# EAGLE design schematic (EAGLE 9.6.2)
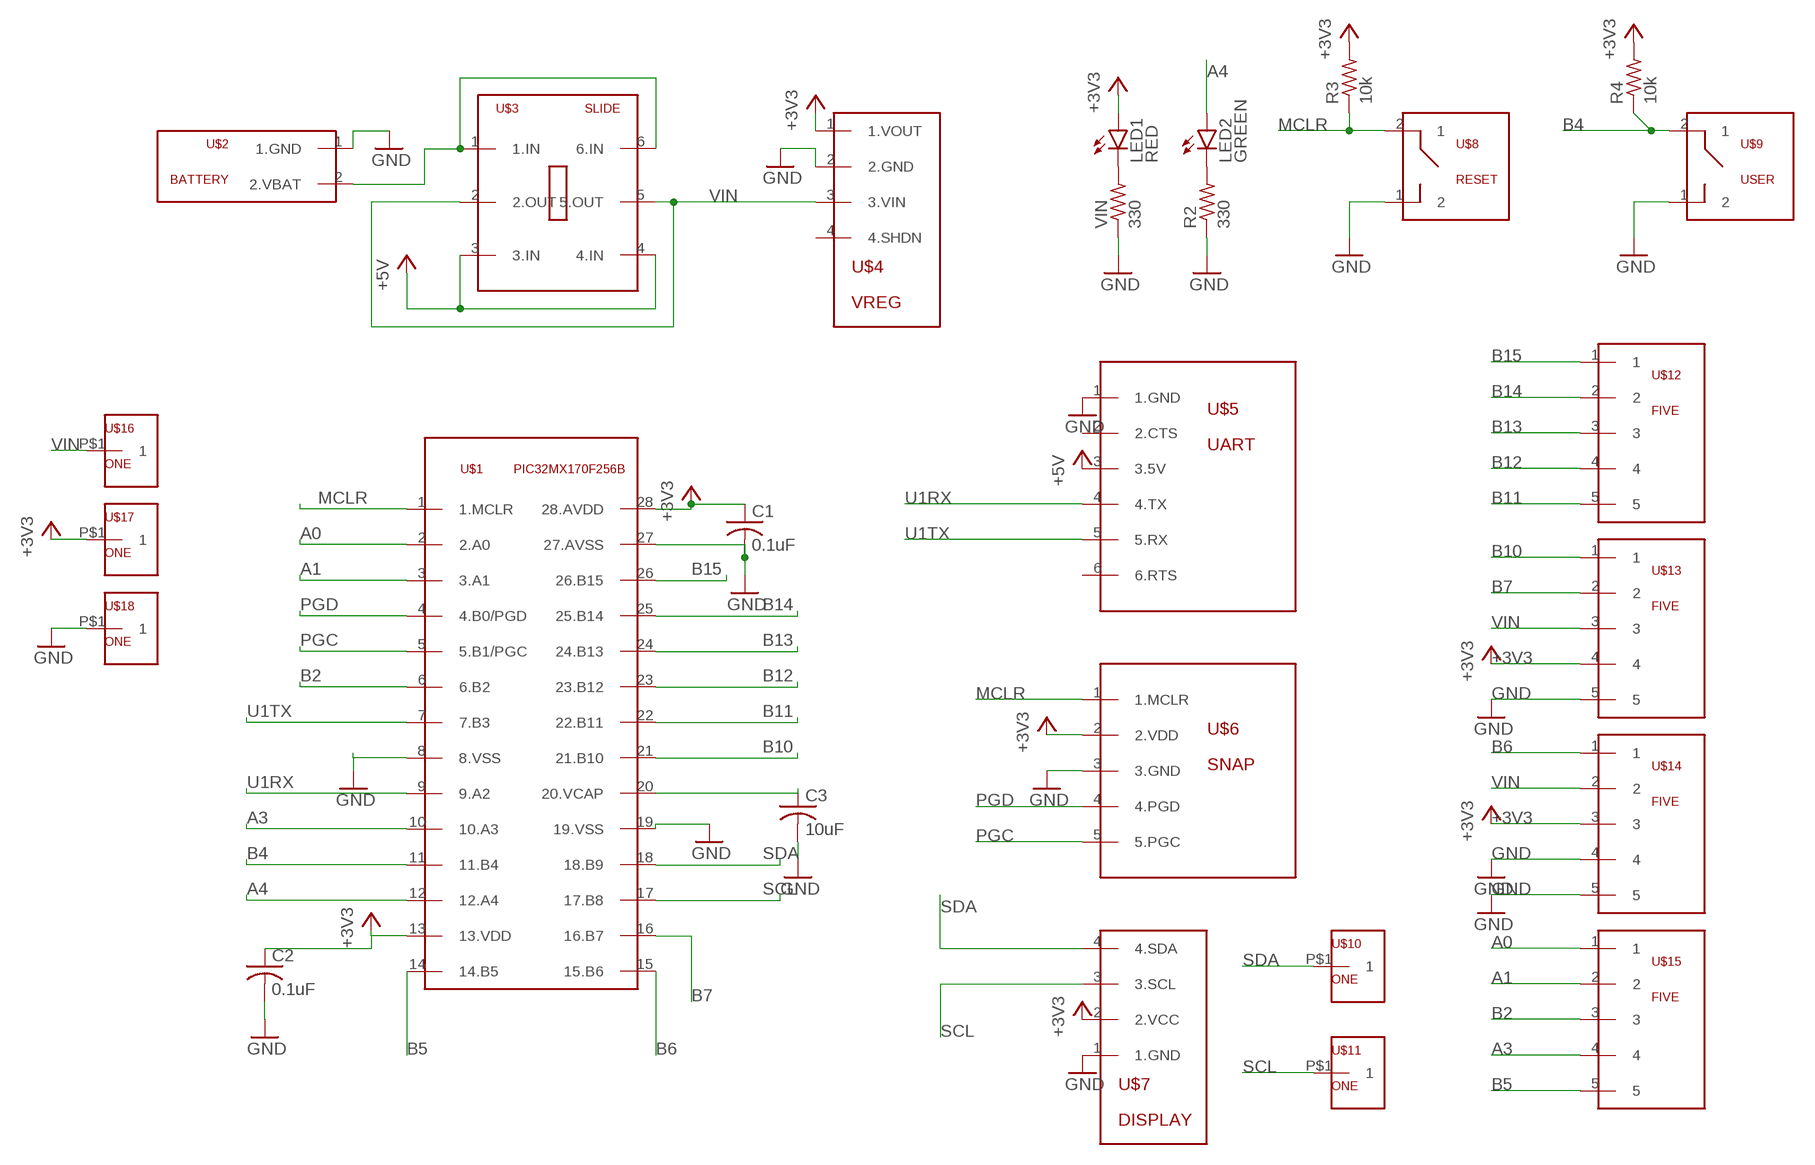
[diagram p0: schematic, sheet 1]

## Parts
C1  0.1uF  C-US025-024X044  [C025-024X044]
C2  0.1uF  C-US025-024X044  [C025-024X044]
C3  10uF  C-US025-024X044  [C025-024X044]
LED1  RED  LED3MM  [LED3MM]
LED2  GREEN  LED3MM  [LED3MM]
R2  330  R-US_0207/7  [0207/7]
R3  10k  R-US_0207/7  [0207/7]
R4  10k  R-US_0207/7  [0207/7]
U$1  PIC32MX170F256B  [DIL28-3]
U$2  BATTERY  [BATTERY]
U$3  SLIDE  [SLIDE]
U$4  VREG  [VREG]
U$5  UART  [USBUART]
U$6  SNAP  [SNAP]
U$7  DISPLAY  [DISPLAY]
U$8  RESET  BUTTON  [PUSH]
U$9  USER  BUTTON  [PUSH]
U$10  ONE  [ONE]
U$11  ONE  [ONE]
U$12  FIVE  [FIVE]
U$13  FIVE  [FIVE]
U$14  FIVE  [FIVE]
U$15  FIVE  [FIVE]
U$16  ONE  [ONE]
U$17  ONE  [ONE]
U$18  ONE  [ONE]
VIN  330  R-US_0207/7  [0207/7]

## Nets
+3V3: C1.1 C2.1 LED1.A R3.2 R4.2 U$1.13(13.VDD) U$1.28(28.AVDD) U$4.1(1.VOUT) U$6.2(2.VDD) U$7.2(2.VCC) U$13.4 U$14.3 U$17.P$1
+5V: U$3.3(3.IN) U$3.4(4.IN) U$5.3(3.5V)
A0: U$1.2(2.A0) U$15.1
A1: U$1.3(3.A1) U$15.2
A3: U$1.10(10.A3) U$15.4
A4: LED2.A U$1.12(12.A4)
B2: U$1.6(6.B2) U$15.3
B4: R4.1 U$1.11(11.B4) U$9.2
B5: U$1.14(14.B5) U$15.5
B6: U$1.15(15.B6) U$14.1
B7: U$1.16(16.B7) U$13.2
B10: U$1.21(21.B10) U$13.1
B11: U$1.22(22.B11) U$12.5
B12: U$1.23(23.B12) U$12.4
B13: U$1.24(24.B13) U$12.3
B14: U$1.25(25.B14) U$12.2
B15: U$1.26(26.B15) U$12.1
GND: C1.2 C2.2 C3.2 R2.1 U$1.8(8.VSS) U$1.19(19.VSS) U$1.27(27.AVSS) U$2.1(1.GND) U$4.2(2.GND) U$5.1(1.GND) U$6.3(3.GND) U$7.1(1.GND) U$8.1 U$9.1 U$13.5 U$14.4 U$14.5 U$18.P$1 VIN.1
MCLR: R3.1 U$1.1(1.MCLR) U$6.1(1.MCLR) U$8.2
N$1: LED1.K(C) VIN.2
N$2: LED2.K(C) R2.2
N$3: U$2.2(2.VBAT) U$3.1(1.IN) U$3.6(6.IN)
N$4: C3.1 U$1.20(20.VCAP)
PGC: U$1.5(5.B1/PGC) U$6.5(5.PGC)
PGD: U$1.4(4.B0/PGD) U$6.4(4.PGD)
SCL: U$1.17(17.B8) U$7.3(3.SCL) U$11.P$1
SDA: U$1.18(18.B9) U$7.4(4.SDA) U$10.P$1
U1RX: U$1.9(9.A2) U$5.4(4.TX)
U1TX: U$1.7(7.B3) U$5.5(5.RX)
VIN: U$3.2(2.OUT) U$3.5(5.OUT) U$4.3(3.VIN) U$13.3 U$14.2 U$16.P$1
Unconnected: U$4.4(4.SHDN) U$5.2(2.CTS) U$5.6(6.RTS)

## Library data of the parts
C1-C3 = hw4:C-US: CAPACITOR, American symbol; SPICEPREFIX: C
LED1 LED2 = hw4:LED: LED OSRAM: - CHIPLED LG R971, LG N971, LY N971, LG Q971, LY Q971, LO R971, LY R971 LH N974, LH R974 LS Q976, LO Q976, LY Q976 LO Q996 - Hyper CHIPLED LW Q18S LB Q993, LB Q99A, LB R99A - SideLED LS A670, LO A670, LY A670, LG A670, LP A670 LB A673, LV A673, LT A673, LW A673 LH A674 LY A675 LS A676, LA A676, LO A676, LY A676, LW A676 LS A679, LY A679, LG A679 - Hyper Micro SIDELED® LS Y876, LA Y876, LO Y876, LY Y876 LT Y87S - SmartLED LW L88C, LW L88S LB L89C, LB L89S, LG L890 LS L89K, LO L89K, LY L89K LS L896, LA L896, LO L896, LY L896 - TOPLED LS T670, LO T670, LY T670, LG T670, LP T670 LSG T670, LSP T670, LSY T670, LOP T670, LYG T670 LG T671, LOG T671, LSG T671 LB T673, LV T673, LT T673, LW T673 LH T674 LS T676, LA T676, LO T676, LY T676, LB T676, LH T676, LSB T676, LW T676 LB T67C, LV T67C, LT T67C, LS T67K, LO T67K, LY T67K, LW E67C LS E67B, LA E67B, LO E67B, LY E67B, LB E67C, LV E67C, LT E67C LW T67C LS T679, LY T679, LG T679 LS T770, LO T770, LY T770, LG T770, LP T770 LB T773, LV T773, LT T773, LW T773 LH T774 LS E675, LA E675, LY E675, LS T675 LS T776, LA T776, LO T776, LY T776, LB T776 LHGB T686 LT T68C, LB T68C - Hyper Mini TOPLED® LB M676 - Mini TOPLED Santana® LG M470 LS M47K, LO M47K, LY M47K Source: http://www.osram.convergy.de LUXEON: - LUMILED® LXK2-PW12-R00, LXK2-PW12-S00, LXK2-PW14-U00, LXK2-PW14-V00 LXK2-PM12-R00, LXK2-PM12-S00, LXK2-PM14-U00 LXK2-PE12-Q00, LXK2-PE12-R00, LXK2-PE12-S00, LXK2-PE14-T00, LXK2-PE14-U00 LXK2-PB12-K00, LXK2-PB12-L00, LXK2-PB12-M00, LXK2-PB14-N00, LXK2-PB14-P00, LXK2-PB14-Q00 LXK2-PR12-L00, LXK2-PR12-M00, LXK2-PR14-Q00, LXK2-PR14-R00 LXK2-PD12-Q00, LXK2-PD12-R00, LXK2-PD12-S00 LXK2-PH12-R00, LXK2-PH12-S00 LXK2-PL12-P00, LXK2-PL12-Q00, LXK2-PL12-R00 Source: www.luxeon.com KINGBRIGHT: KA-3528ASYC Source: www.kingbright.com
R2-R4 VIN = hw4:R-US_: RESISTOR, American symbol; SPICEPREFIX: R
U$1 = hw4:PIC32MX170F256B
U$2 = hw4:BATTERY
U$3 = hw4:SLIDE
U$4 = hw4:VREG
U$5 = hw4:UART
U$6 = hw4:SNAP
U$7 = hw4:DISPLAY
U$8 U$9 = hw4:BUTTON
U$10 U$11 U$16-U$18 = hw4:ONE
U$12-U$15 = hw4:FIVE

## Board
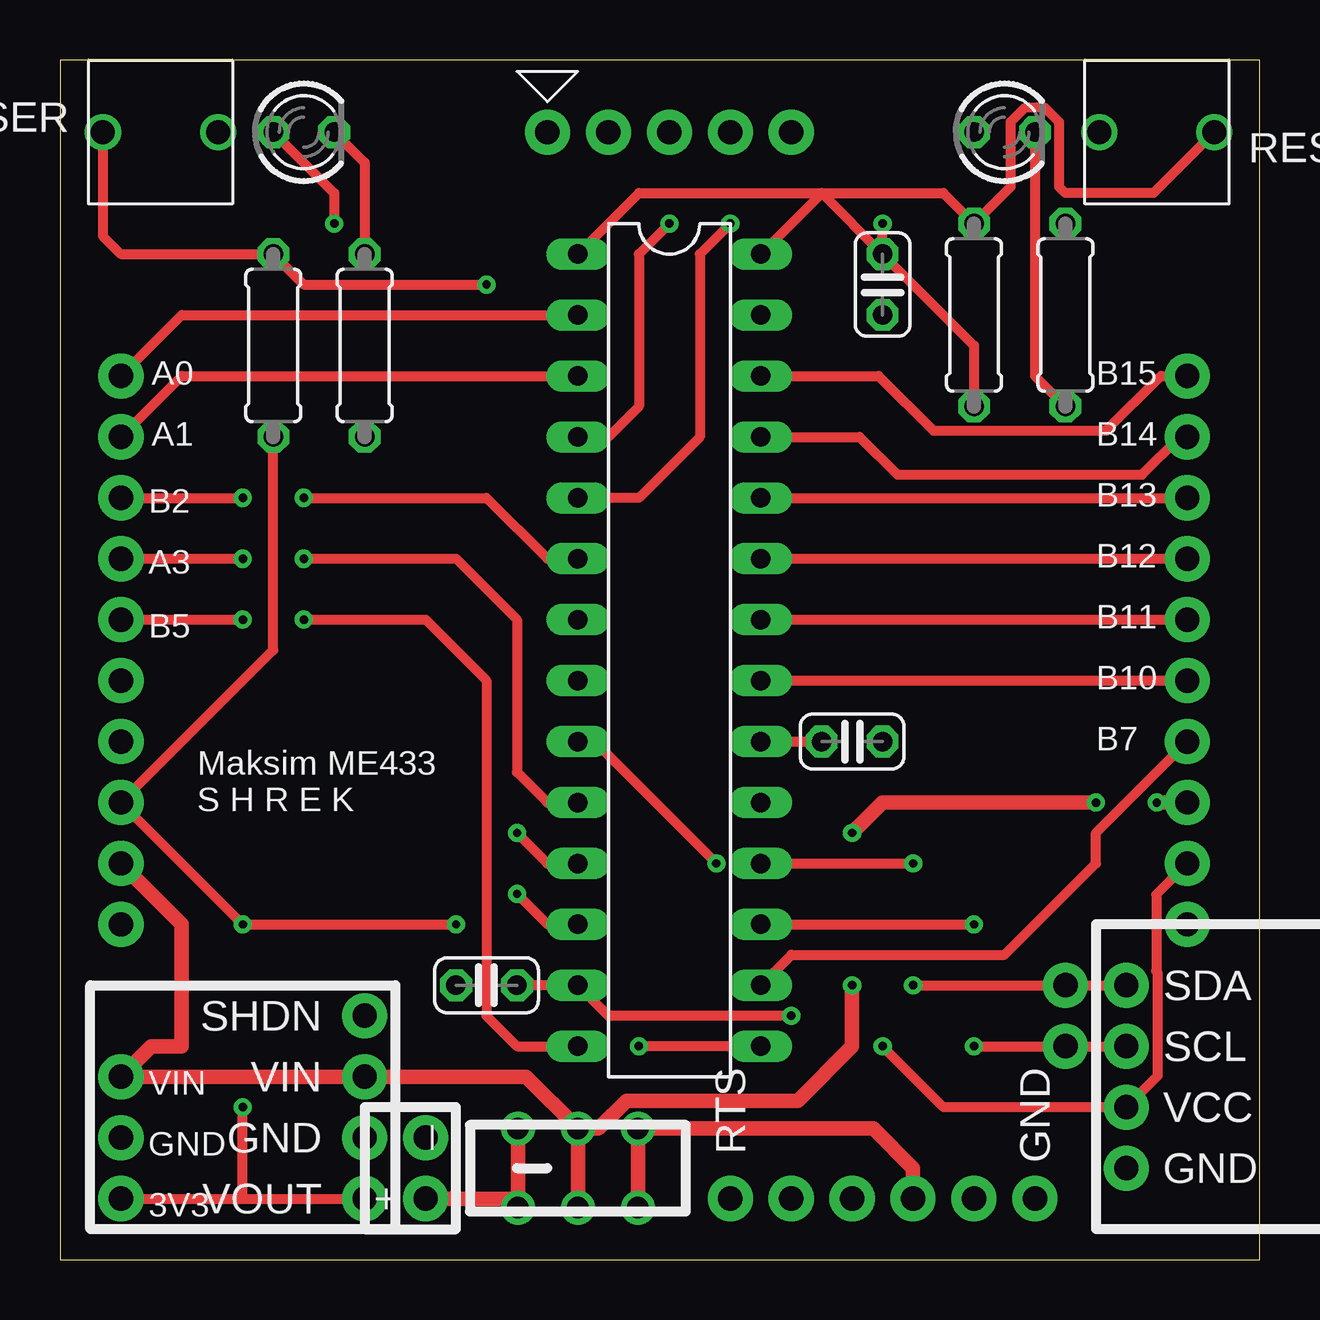
[diagram p1: board, top side]
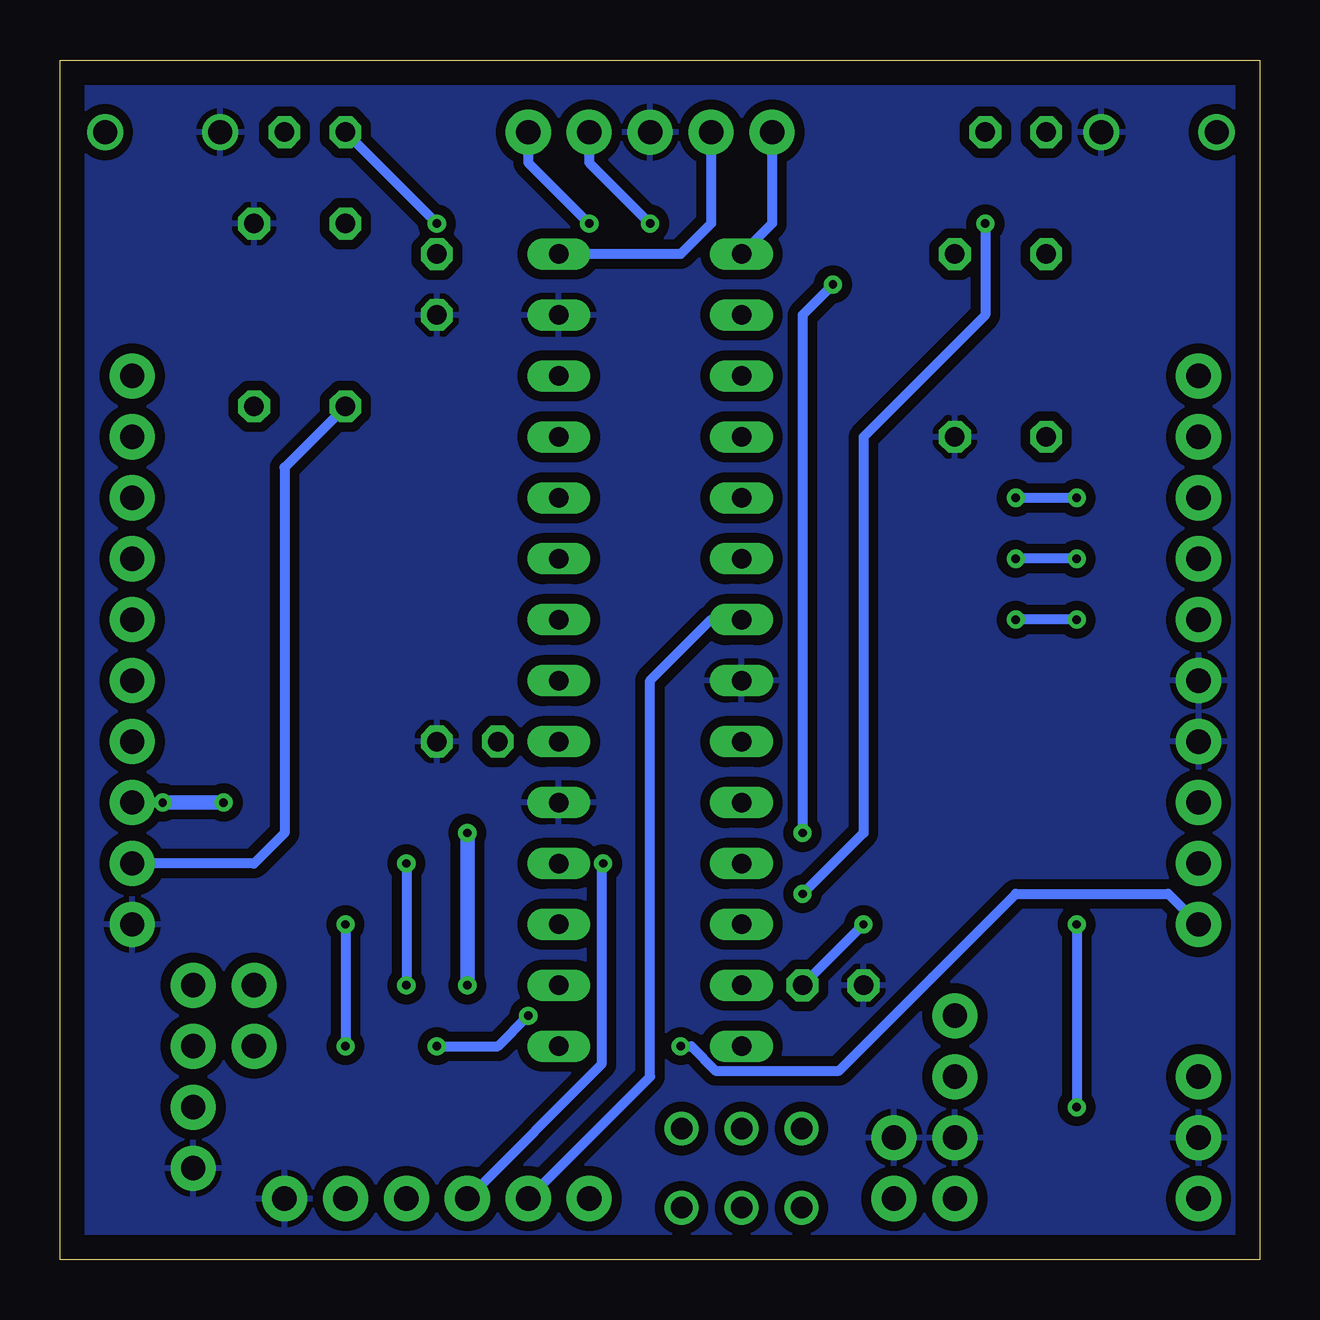
[diagram p2: board, bottom side, seen from below]

Size 50 x 50 mm. Coordinates in mm from the lower left corner, seen from the top.
Outline: 0,0 50,0 50,50 0,50 0,0
Copper layers (1*16): Top 0.035mm / dielectric 1.5mm / Bottom 0.035mm
Design rules "default": minimum track width 6mil, minimum drill 0.35mm, track to track 6mil, track to pad 6mil, pad to pad 6mil, via to via 6mil, smd to smd 6mil, copper to edge 40mil, drill to drill 6mil, minimum pad ring 10mil, minimum via ring 8mil, stop-mask expansion 4mil, vias tented up to drill 0mil, thermal gap 10mil

### Footprints (pad centres in the part's own frame; a part is rotated, then mirrored left to right if it is on the bottom)
C025-024X044 = drill 0.813 octagon: 1 -1.27,0; 2 1.27,0
LED3MM = drill 0.813 octagon: A -1.27,0; K 1.27,0
0207/7 = drill 0.813 octagon: 1 -3.81,0; 2 3.81,0
DIL28-3 = drill 0.813 long: 1 -16.51,-3.81; 2 -13.97,-3.81; 3 -11.43,-3.81; 4 -8.89,-3.81; 5 -6.35,-3.81; 6 -3.81,-3.81; 7 -1.27,-3.81; 8 1.27,-3.81; 9 3.81,-3.81; 10 6.35,-3.81; 11 8.89,-3.81; 12 11.43,-3.81; 13 13.97,-3.81; 14 16.51,-3.81; 15 16.51,3.81; 16 13.97,3.81; 17 11.43,3.81; 18 8.89,3.81; 19 6.35,3.81; 20 3.81,3.81; 21 1.27,3.81; 22 -1.27,3.81; 23 -3.81,3.81; 24 -6.35,3.81; 25 -8.89,3.81; 26 -11.43,3.81; 27 -13.97,3.81; 28 -16.51,3.81
BATTERY = drill 1.016 pad 1.88: 1 -1.27,0; 2 1.27,0
SLIDE = drill 0.9: 1 -2.5,-1.65; 2 0,-1.65; 3 2.5,-1.65; 4 2.5,1.65; 5 0,1.65; 6 -2.5,1.65
VREG = drill 1.016 pad 1.88: 1 -3.81,0; 2 -1.27,0; 3 1.27,0; 4 3.81,0
USBUART = drill 1.016 pad 1.88: 1 -6.35,0; 2 -3.81,0; 3 -1.27,0; 4 1.27,0; 5 3.81,0; 6 6.35,0
SNAP = drill 1.016 pad 1.88: 1 -5.08,0; 2 -2.54,0; 3 0,0; 4 2.54,0; 5 5.08,0
DISPLAY = drill 1.016 pad 1.88: 1 0,-3.81; 2 0,-1.27; 3 0,1.27; 4 0,3.81
PUSH = drill 1: 1 -2.4,0; 2 2.4,0
ONE = drill 1.016 pad 1.88: P$1 0,0
FIVE = drill 1.016 pad 1.88: 1 -5.08,0; 2 -2.54,0; 3 0,0; 4 2.54,0; 5 5.08,0

### Placement (x,y rotation side)
C1  34.29,40.64 270 top
C2  17.78,11.43 180 top
C3  33.02,21.59 0 top
LED1  39.37,46.99 0 top
LED2  10.16,46.99 0 top
R2  12.7,38.1 90 top
R3  38.1,39.37 270 top
R4  8.89,38.1 270 top
U$1  25.4,25.4 270 top
U$2  15.24,3.81 270 top
U$3  21.59,3.81 0 top
U$4  12.7,6.35 90 top
U$5  34.29,2.54 180 top
U$6  25.4,46.99 0 top
U$7  44.45,7.62 0 top
U$8  45.72,46.99 0 top
U$9  4.19,46.99 180 top
U$10  41.91,11.43 0 top
U$11  41.91,8.89 0 top
U$12  46.99,31.75 270 top
U$13  46.99,19.05 270 top
U$14  2.54,19.05 90 top
U$15  2.54,31.75 270 top
U$16  2.54,7.62 0 top
U$17  2.54,2.54 0 top
U$18  2.54,5.08 0 top
VIN  41.91,39.37 270 top

### Tracks (layer width: path | path; a pad name or v marks a point on that pad's centre or on a via)
+3V3  (via drill 0.35)
  Top 0.406: C2.1 U$1.13 22.86,10.16 v30.48,10.16 | U$1.28 31.75,44.45 C1.1 | C1.1 v34.29,43.18 | C1.1 38.1,38.1 R3.2 | U$13.4 45.7,15.21 45.7,12.02 45.74,11.97 45.74,7.64 U$7.2 36.83,6.35 v34.29,8.89 | R4.2 8.89,25.4 U$14.3 v7.62,13.97 v16.51,13.97 | U$17.P$1 7.62,2.54 | 7.62,2.54 U$4.1 | 7.62,2.54 v7.62,6.35
  Bottom 0.406: v34.29,43.18 LED1.A | U$6.2 22.86,43.18 24.13,41.91 U$1.28 | v7.62,13.97 v7.62,6.35 | v16.51,13.97 C2.1 | v34.29,8.89 31.75,8.89 v30.48,10.16 | R3.2 40.64,33.02 40.64,17.78 41.91,16.51 U$13.4
+5V
  Top 0.61: U$3.3 U$3.4 33.91,5.46 35.56,3.81 U$5.3
A0
  Top 0.406: U$15.1 5.08,39.37 U$1.2
A1
  Top 0.406: U$15.2 5.08,36.83 U$1.3
A3  (via drill 0.35)
  Top 0.406: U$15.4 v7.62,29.21 | v10.16,29.21 16.51,29.21 19.05,26.67 19.05,20.32 20.32,19.05 U$1.10
  Bottom 0.406: v7.62,29.21 v10.16,29.21
A4  (via drill 0.35)
  Top 0.406: LED2.A 11.43,44.45 v11.43,43.18 | v19.05,15.24 20.32,13.97 U$1.12
  Bottom 0.406: v11.43,43.18 11.43,39.37 16.51,34.29 16.51,17.78 v19.05,15.24
B2  (via drill 0.35)
  Top 0.406: U$15.3 v7.62,31.75 | v10.16,31.75 17.78,31.75 20.32,29.21 U$1.6
  Bottom 0.406: v7.62,31.75 v10.16,31.75
B4  (via drill 0.35)
  Top 0.406: U$9.2 1.79,42.66 2.54,41.91 R4.1 10.16,40.64 v17.78,40.64 | v19.05,17.78 20.32,16.51 U$1.11
  Bottom 0.406: v17.78,40.64 19.05,39.37 v19.05,17.78
B5  (via drill 0.35)
  Top 0.406: U$15.5 v7.62,26.67 | v10.16,26.67 15.24,26.67 17.78,24.13 17.78,10.16 19.05,8.89 U$1.14
  Bottom 0.406: v7.62,26.67 v10.16,26.67
B6  (via drill 0.35)
  Top 0.406: U$1.15 v24.13,8.89
  Bottom 0.406: v24.13,8.89 23.69,8.89 22.67,7.87 17.53,7.87 10.16,15.24 3.81,15.24 U$14.1
B7
  Top 0.406: U$1.16 30.48,12.7 39.37,12.7 43.18,16.51 43.18,17.78 U$13.2
B10
  Top 0.406: U$1.21 U$13.1
B11
  Top 0.406: U$1.22 U$12.5
B12
  Top 0.406: U$1.23 U$12.4
B13
  Top 0.406: U$1.24 U$12.3
B14
  Top 0.406: U$1.25 33.33,34.29 34.91,32.72 45.1,32.72 46.68,34.29 U$12.2
B15
  Top 0.406: U$1.26 34.12,36.83 36.41,34.54 43.6,34.54 45.89,36.83 U$12.1
GND
  pour Bottom (isolate 0.406): 0,0 50.8,0 50.8,50.8 0,50.8
MCLR
  Top 0.406: U$8.2 45.58,44.45 41.91,44.45 41.66,44.7 41.66,47.41 41.06,48.01 40.22,48.01 39.62,47.41 39.62,44.7 R3.1 36.83,44.45 24.13,44.45 U$1.1
  Bottom 0.406: U$6.1 20.32,43.18 U$1.1
N$1
  Top 0.406: LED1.K 40.64,36.83 VIN.2
N$2
  Top 0.406: LED2.K 12.7,45.72 R2.2
N$3
  Top 0.61: U$3.6 U$3.1 18.71,2.54 U$2.2
N$4
  Top 0.406: U$1.20 C3.1
PGC  (via drill 0.35)
  Top 0.406: v27.94,43.18 26.67,41.91 26.67,34.29 24.13,31.75 U$1.5
  Bottom 0.406: U$6.5 30.48,45.72 v27.94,43.18
PGD  (via drill 0.35)
  Top 0.406: v25.4,43.18 24.13,41.91 24.13,35.56 22.86,34.29 U$1.4
  Bottom 0.406: U$6.4 27.94,45.72 v25.4,43.18
SCL  (via drill 0.35)
  Top 0.406: U$1.17 v38.1,13.97 | v38.1,8.89 U$11.P$1 U$7.3
  Bottom 0.406: v38.1,13.97 v38.1,8.89
SDA  (via drill 0.35)
  Top 0.406: U$1.18 v35.56,16.51 | v35.56,11.43 U$10.P$1 U$7.4
  Bottom 0.406: v35.56,16.51 v35.56,11.43
U1RX  (via drill 0.35)
  Top 0.406: v27.36,16.51 22.28,21.59 U$1.9
  Bottom 0.406: U$5.4 27.43,8.13 27.43,16.44 v27.36,16.51
U1TX
  Bottom 0.406: U$1.7 22.86,26.67 25.4,24.13 25.4,7.62 U$5.5
VIN  (via drill 0.35)
  Top 0.61: U$3.5 U$3.2 | U$3.5 19.43,7.62 U$4.3 U$16.P$1 3.81,8.89 5.08,8.89 5.08,13.97 U$14.2 | U$3.5 22.45,5.46 23.61,6.62 30.75,6.62 33.02,8.89 v33.02,11.43 | v33.02,17.78 34.29,19.05 v43.18,19.05 | v45.72,19.05 U$13.3
  Bottom 0.61: v33.02,11.43 v33.02,17.78 | v43.18,19.05 v45.72,19.05

### Text on the board
tPlace: A0 | B15 | A1 | B14 | B2 | B13 | A3 | B12 | B5 | B11 | B10 | B7 | Maksim ME433 / S H R E K | VIN | GND | 3V3